# Altium schematic sheet EEPROM&Flash.SchDoc
size A4
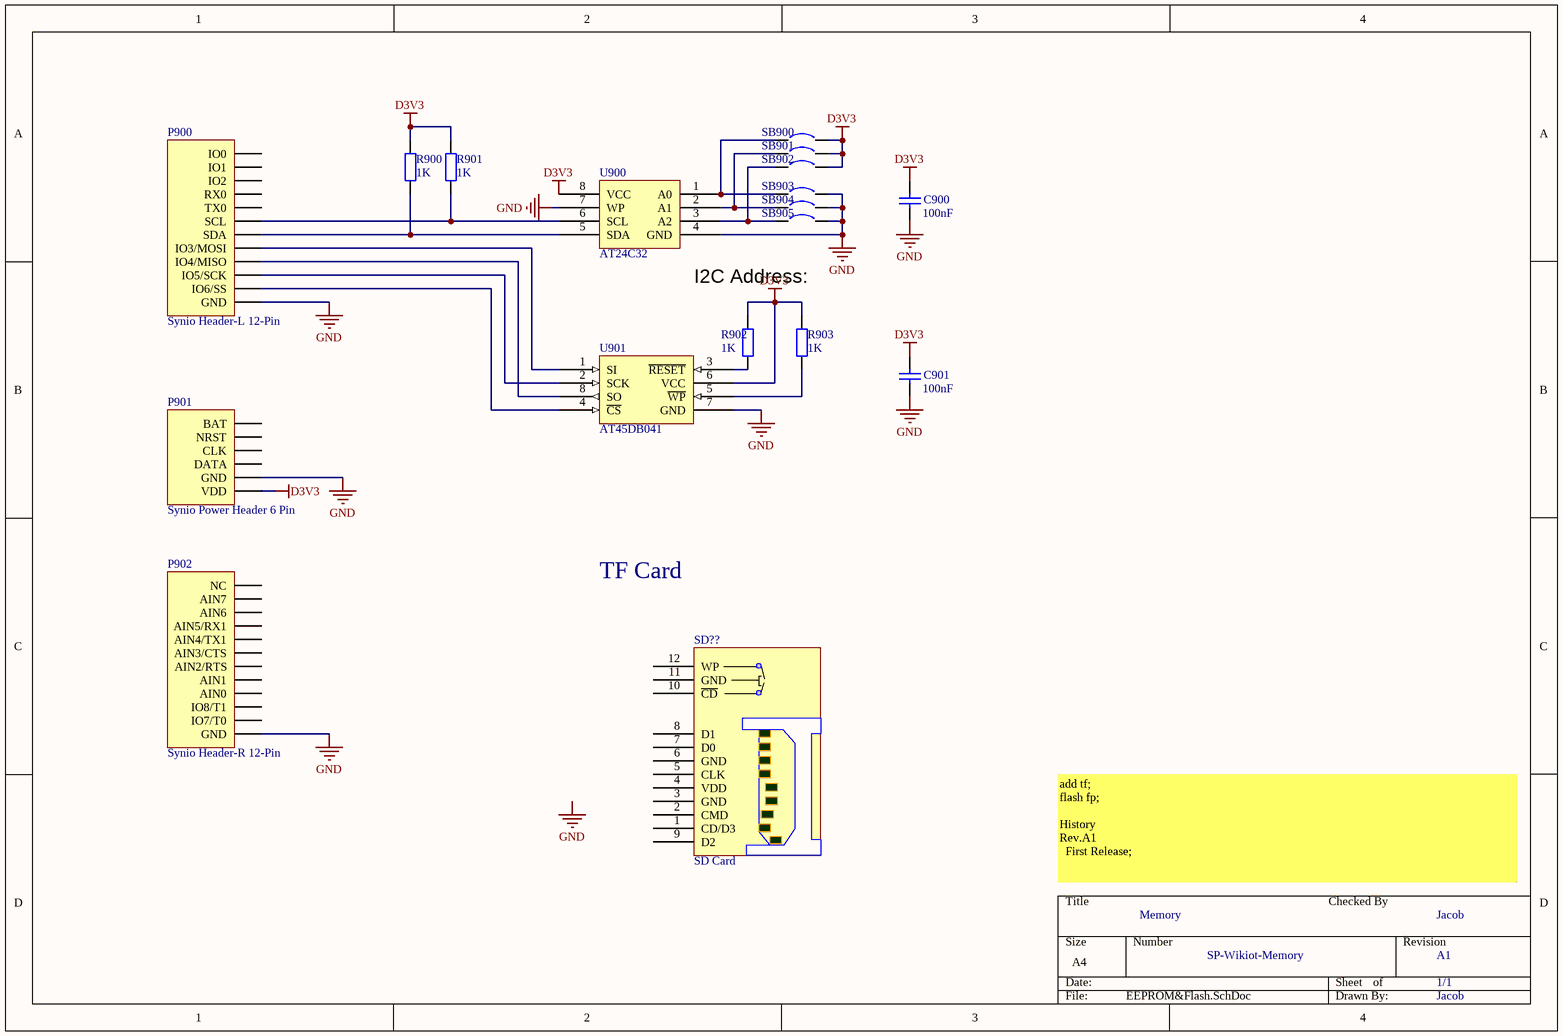
[diagram p0: EEPROM&Flash.SchDoc]

## Parts
C900  100nF  [C0603L]
C901  100nF  [C0603L]
P900  Synio Header-L 12-Pin  [HDR1X12/2.54MM]
P901  Synio Power Header 6 Pin  [HDR1X6/2.54MM]
P902  Synio Header-R 12-Pin  [HDR1X12/2.54MM]
R900  1K  [R0603]
R901  1K  [R0603]
R902  1K  [R0603]
R903  1K  [R0603]
SB900  Circuit Breaker  [JP2_SMD]  (value not drawn)
SB901  Circuit Breaker  [JP2_SMD]  (value not drawn)
SB902  Circuit Breaker  [JP2_SMD]  (value not drawn)
SB903  Circuit Breaker  [JP2_SMD]  (value not drawn)
SB904  Circuit Breaker  [JP2_SMD]  (value not drawn)
SB905  Circuit Breaker  [JP2_SMD]  (value not drawn)
SD??  SD Card  [sd1]
U900  AT24C32  [SO8W_M]
U901  AT45DB041  [SO8_N]

## Nets
D3V3: C900.1 C901.1 P901.1(VDD) R900.2 R901.2 R902.1 R903.1 SB900.2 SB901.2 SB902.2 U900.8(VCC) U901.6(VCC)
GND: C900.2 C901.2 P900.1(GND) P901.2(GND) P902.1(GND) SB903.2 SB904.2 SB905.2 U900.4(GND) U900.7(WP) U901.7(GND)
NetP900_2: P900.2(IO6/SS) U901.4(~{CS})
NetP900_3: P900.3(IO5/SCK) U901.2(SCK)
NetP900_4: P900.4(IO4/MISO) U901.8(SO)
NetP900_5: P900.5(IO3/MOSI) U901.1(SI)
NetP900_6: P900.6(SDA) R900.1 U900.5(SDA)
NetP900_7: P900.7(SCL) R901.1 U900.6(SCL)
NetR902_2: R902.2 U901.3(~{RESET})
NetR903_2: R903.2 U901.5(~{WP})
NetSB900_1: SB900.1 SB903.1 U900.1(A0)
NetSB901_1: SB901.1 SB904.1 U900.2(A1)
NetSB902_1: SB902.1 SB905.1 U900.3(A2)

Not connected (* = marked no-connect by the designer): P900 8(TX0) 9(RX0) 10(IO2) 11(IO1) 12(IO0); P901 3(DATA) 4(CLK) 5(NRST) 6(BAT); P902 2(IO7/T0) 3(IO8/T1) 4(AIN0) 5(AIN1) 6(AIN2/RTS) 7(AIN3/CTS) 8(AIN4/TX1) 9(AIN5/RX1) 10(AIN6) 11(AIN7) 12(NC); SD?? 1(CD/D3) 2(CMD) 3(GND) 4(VDD) 5(CLK) 6(GND) 7(D0) 8(D1) 9(D2) 10(~{CD}) 11(GND) 12(WP)

## Notes on the sheet
- (near U900) I2C Address:
- TF Card
- add tf;
  flash fp;
  History
  Rev.A1
  First Release;
- Memory
- Checked By
- Jacob
- SP-Wikiot-Memory
- A1
- 1/1
- Labels drawn without touching a wire or pin: GND

## Library data of the parts
C900 C901 = Cap: Capacitor; Value: 10nF; Published: 8-Jun-2000; Revision: July-2002: Re-released for DXP Platform.; Publisher: Altium Limited
P900 = Synio Header-L 12-Pin: Synio Header-L, 12-Pin; LatestRevisionDate: 17-Jul-2002; LatestRevisionNote: Re-released for DXP Platform.; Publisher: Altium Limited
P902 = Synio Header-R 12-Pin: Synio Header-R, 12-Pin; LatestRevisionDate: 17-Jul-2002; LatestRevisionNote: Re-released for DXP Platform.; Publisher: Altium Limited
R900-R903 = Res2: Resistor; Published: 8-Jun-2000; LatestRevisionDate: 17-Jul-2002; LatestRevisionNote: Re-released for DXP Platform.; PackageReference: AXIAL-0.4; Publisher: Altium Limited; Value: 1K
SB900-SB905 = Circuit Breaker: Solder: YES; Published: 24-Mar-1999; Revision: July-2002: Re-released for DXP Platform.; Publisher: Altium Limited
U900 = At24CXX: IIC EEPROM
U901 = AT45DB041: 4M Serial Flash